# EAGLE design tof (EAGLE 6.5.0)
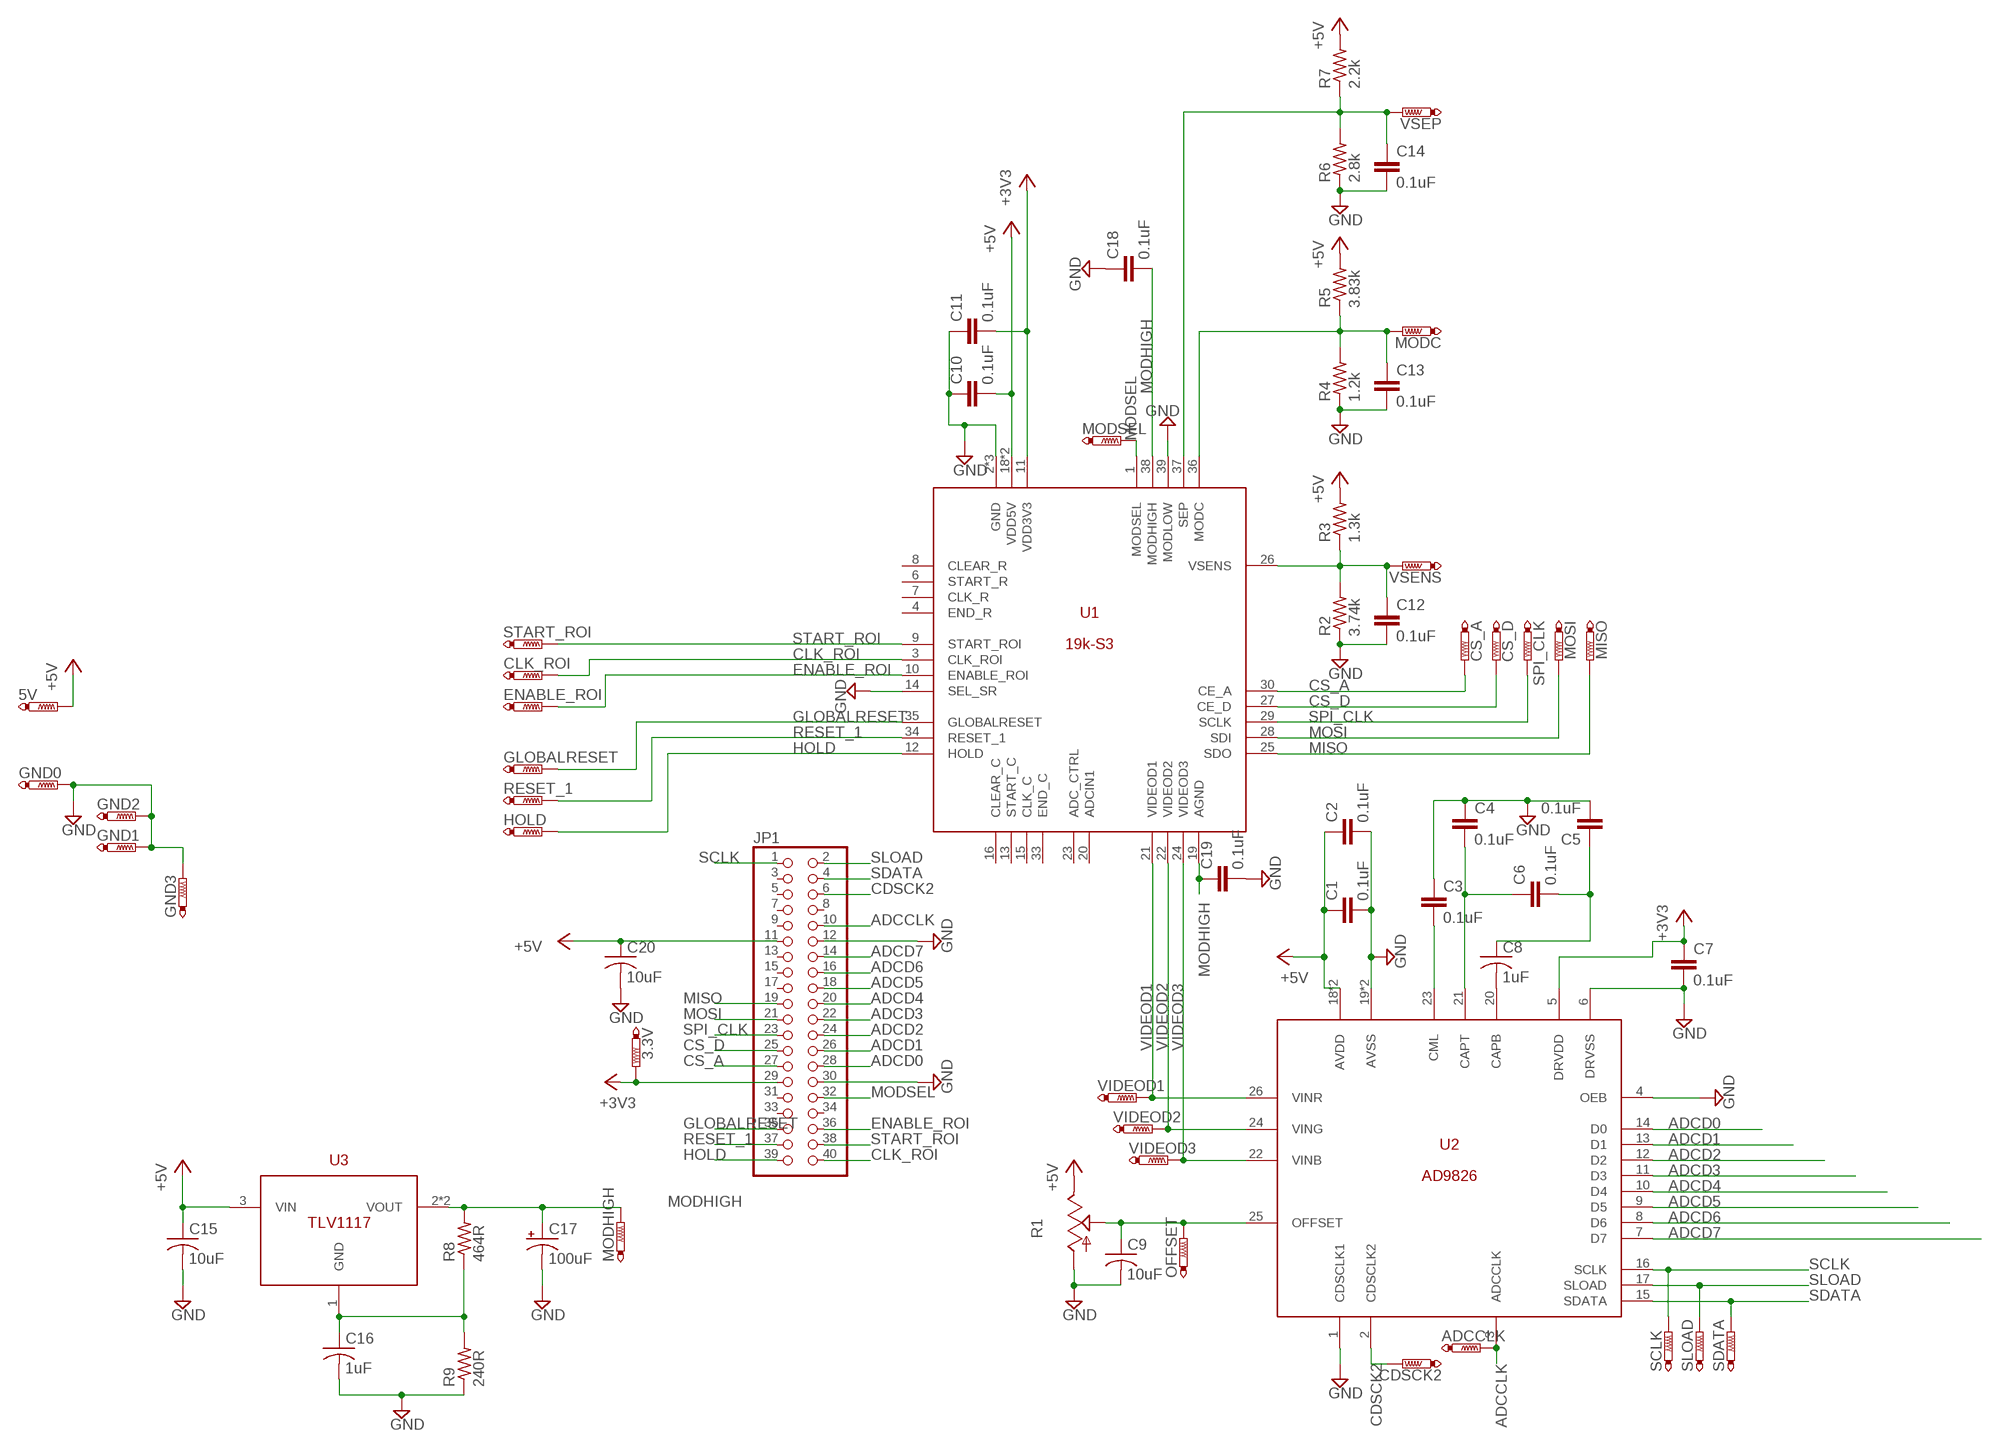
[diagram p0: schematic, sheet 1]

## Parts
3.3V  PTR1PAD1-13  [P1-13]
5V  PTR1PAD1-13  [P1-13]
ADCCLK  PTR1PAD1-13  [P1-13]
C1  0.1uF  C-EUC0805  [C0805]
C2  0.1uF  C-EUC0805  [C0805]
C3  0.1uF  C-EUC0805  [C0805]
C4  0.1uF  C-EUC0805  [C0805]
C5  0.1uF  C-EUC0805  [C0805]
C6  0.1uF  C-EUC0805  [C0805]
C7  0.1uF  C-EUC0805  [C0805]
C8  1uF  C-USC0805  [C0805]
C9  10uF  C-USC0805  [C0805]
C10  0.1uF  C-EUC0805  [C0805]
C11  0.1uF  C-EUC0805  [C0805]
C12  0.1uF  C-EUC0805  [C0805]
C13  0.1uF  C-EUC0805  [C0805]
C14  0.1uF  C-EUC0805  [C0805]
C15  10uF  C-USC0805  [C0805]
C16  1uF  C-USC0805  [C0805]
C17  100uF  CPOL-USF  [PANASONIC_F]
C18  0.1uF  C-EUC0805  [C0805]
C19  0.1uF  C-EUC0805  [C0805]
C20  10uF  C-USC0805  [C0805]
CDSCK2  PTR1PAD1-13  [P1-13]
CLK_ROI  PTR1PAD1-13  [P1-13]
CS_A  PTR1PAD1-13  [P1-13]
CS_D  PTR1PAD1-13  [P1-13]
ENABLE_ROI  PTR1PAD1-13  [P1-13]
GLOBALRESET  PTR1PAD1-13  [P1-13]
GND0  PTR1PAD1-13  [P1-13]
GND1  PTR1PAD1-13  [P1-13]
GND2  PTR1PAD1-13  [P1-13]
GND3  PTR1PAD1-13  [P1-13]
HOLD  PTR1PAD1-13  [P1-13]
JP1  PINHD-2X20  [SMD-40]
MISO  PTR1PAD1-13  [P1-13]
MODC  PTR1PAD1-13  [P1-13]
MODHIGH  PTR1PAD1-13  [P1-13]
MODSEL  PTR1PAD1-13  [P1-13]
MOSI  PTR1PAD1-13  [P1-13]
OFFSET  PTR1PAD1-13  [P1-13]
R1  TRIM_US-S63P  [S63P]
R2  3.74k  R-US_R0805  [R0805]
R3  1.3k  R-US_R0805  [R0805]
R4  1.2k  R-US_R0805  [R0805]
R5  3.83k  R-US_R0805  [R0805]
R6  2.8k  R-US_R0805  [R0805]
R7  2.2k  R-US_R0805  [R0805]
R8  464R  R-US_R0805  [R0805]
R9  240R  R-US_R0805  [R0805]
RESET_1  PTR1PAD1-13  [P1-13]
SCLK  PTR1PAD1-13  [P1-13]
SDATA  PTR1PAD1-13  [P1-13]
SLOAD  PTR1PAD1-13  [P1-13]
SPI_CLK  PTR1PAD1-13  [P1-13]
START_ROI  PTR1PAD1-13  [P1-13]
U1  19K-S3  [TLCC40]
U2  AD9826  [SSOP28]
U3  TLV1117  [SOT223]
VIDEOD1  PTR1PAD1-13  [P1-13]
VIDEOD2  PTR1PAD1-13  [P1-13]
VIDEOD3  PTR1PAD1-13  [P1-13]
VSENS  PTR1PAD1-13  [P1-13]
VSEP  PTR1PAD1-13  [P1-13]

## Nets
+3V3: 3.3V.TP C7.1 C11.2 JP1.29 U1.11(VDD3V3) U2.5(DRVDD)
+5V: 5V.TP C1.1 C2.1 C10.2 C15.1 C20.1 JP1.11 R1.E R3.2 R5.2 R7.2 U1.18(VDD5V) U1.40(VDD5V) U2.18(AVDD) U2.28(AVDD) U3.3(VIN)
ADCCLK: ADCCLK.TP JP1.10 U2.3(ADCCLK)
ADCD0: JP1.28 U2.14(D0)
ADCD1: JP1.26 U2.13(D1)
ADCD2: JP1.24 U2.12(D2)
ADCD3: JP1.22 U2.11(D3)
ADCD4: JP1.20 U2.10(D4)
ADCD5: JP1.18 U2.9(D5)
ADCD6: JP1.16 U2.8(D6)
ADCD7: JP1.14 U2.7(D7)
CAPT: C4.2 C6.1 U2.21(CAPT)
CDSCK2: CDSCK2.TP JP1.6 U2.2(CDSCLK2)
CLK_ROI: CLK_ROI.TP JP1.40 U1.3(CLK_ROI)
CML: C3.2 U2.23(CML)
CS_A: CS_A.TP JP1.27 U1.30(CE_A)
CS_D: CS_D.TP JP1.25 U1.27(CE_D)
ENABLE_ROI: ENABLE_ROI.TP JP1.36 U1.10(ENABLE_ROI)
GLOBALRESET: GLOBALRESET.TP JP1.35 U1.35(GLOBALRESET)
GND: C1.2 C2.2 C3.1 C4.1 C5.2 C7.2 C9.2 C10.1 C11.1 C12.2 C13.2 C14.2 C15.2 C16.2 C17.- C18.1 C19.2 C20.2 GND0.TP GND1.TP GND2.TP GND3.TP JP1.12 JP1.30 R1.A R2.1 R4.1 R6.1 R9.1 U1.2(GND) U1.5(GND) U1.14(SEL_SR) U1.39(MODLOW) U1.PAD(GND) U2.1(CDSCLK1) U2.4(OEB) U2.6(DRVSS) U2.19(AVSS) U2.27(AVSS)
HOLD: HOLD.TP JP1.39 U1.12(HOLD)
MISO: JP1.19 MISO.TP U1.25(SDO)
MODHIGH: C17.+ C18.2 C19.1 MODHIGH.TP R8.2 U1.19(AGND) U1.38(MODHIGH) U3.2(VOUT) U3.4(VOUT)
MODSEL: JP1.32 MODSEL.TP U1.1(MODSEL)
MOSI: JP1.21 MOSI.TP U1.28(SDI)
N$2: C9.1 OFFSET.TP R1.S U2.25(OFFSET)
N$3: C8.2 U2.20(CAPB)
N$4: C5.1 C6.2 C8.1
N$6: C16.1 R8.1 R9.2 U3.1(GND)
N$15: C12.1 R2.2 R3.1 U1.26(VSENS) VSENS.TP
N$17: C13.1 MODC.TP R4.2 R5.1 U1.36(MODC)
N$20: C14.1 R6.2 R7.1 U1.37(SEP) VSEP.TP
RESET_1: JP1.37 RESET_1.TP U1.34(RESET_1)
SCLK: JP1.1 SCLK.TP U2.16(SCLK)
SDATA: JP1.4 SDATA.TP U2.15(SDATA)
SLOAD: JP1.2 SLOAD.TP U2.17(SLOAD)
SPI_CLK: JP1.23 SPI_CLK.TP U1.29(SCLK)
START_ROI: JP1.38 START_ROI.TP U1.9(START_ROI)
VIDEOD1: U1.21(VIDEOD1) U2.26(VINR) VIDEOD1.TP
VIDEOD2: U1.22(VIDEOD2) U2.24(VING) VIDEOD2.TP
VIDEOD3: U1.24(VIDEOD3) U2.22(VINB) VIDEOD3.TP
Unconnected: JP1.3 JP1.5 JP1.7 JP1.8 JP1.9 JP1.13 JP1.15 JP1.17 JP1.31 JP1.33 JP1.34 U1.4(END_R) U1.6(START_R) U1.7(CLK_R) U1.8(CLEAR_R) U1.13(START_C) U1.15(CLK_C) U1.16(CLEAR_C) U1.20(ADCIN1) U1.23(ADC_CTRL) U1.33(END_C)

## Library data of the parts
3.3V 5V ADCCLK CDSCK2 CLK_ROI CS_A CS_D ENABLE_ROI GLOBALRESET GND0 GND1-GND3 HOLD MISO MODC MODHIGH MODSEL MOSI OFFSET RESET_1 SCLK SDATA SLOAD SPI_CLK START_ROI VIDEOD1-VIDEOD3 VSENS VSEP = testpad:PTR1: TEST PIN
C1-C7 C10-C14 C18 C19 = rcl:C-EU: CAPACITOR, European symbol
C8 C9 C15 C16 C20 = rcl:C-US: CAPACITOR, American symbol
C17 = rcl:CPOL-US: POLARIZED CAPACITOR, American symbol
JP1 = tof_v3:PINHD-2X20: PIN HEADER
R1 = pot:TRIM_US-: POTENTIOMETER
R2-R9 = rcl:R-US_: RESISTOR, American symbol
U1 = tof_v3:19K-S3
U2 = tof_v3:AD9826: 16-bit RGB ADC
U3 = tof_v3:TLV1117: Adjustable Voltage Regulator

## Board
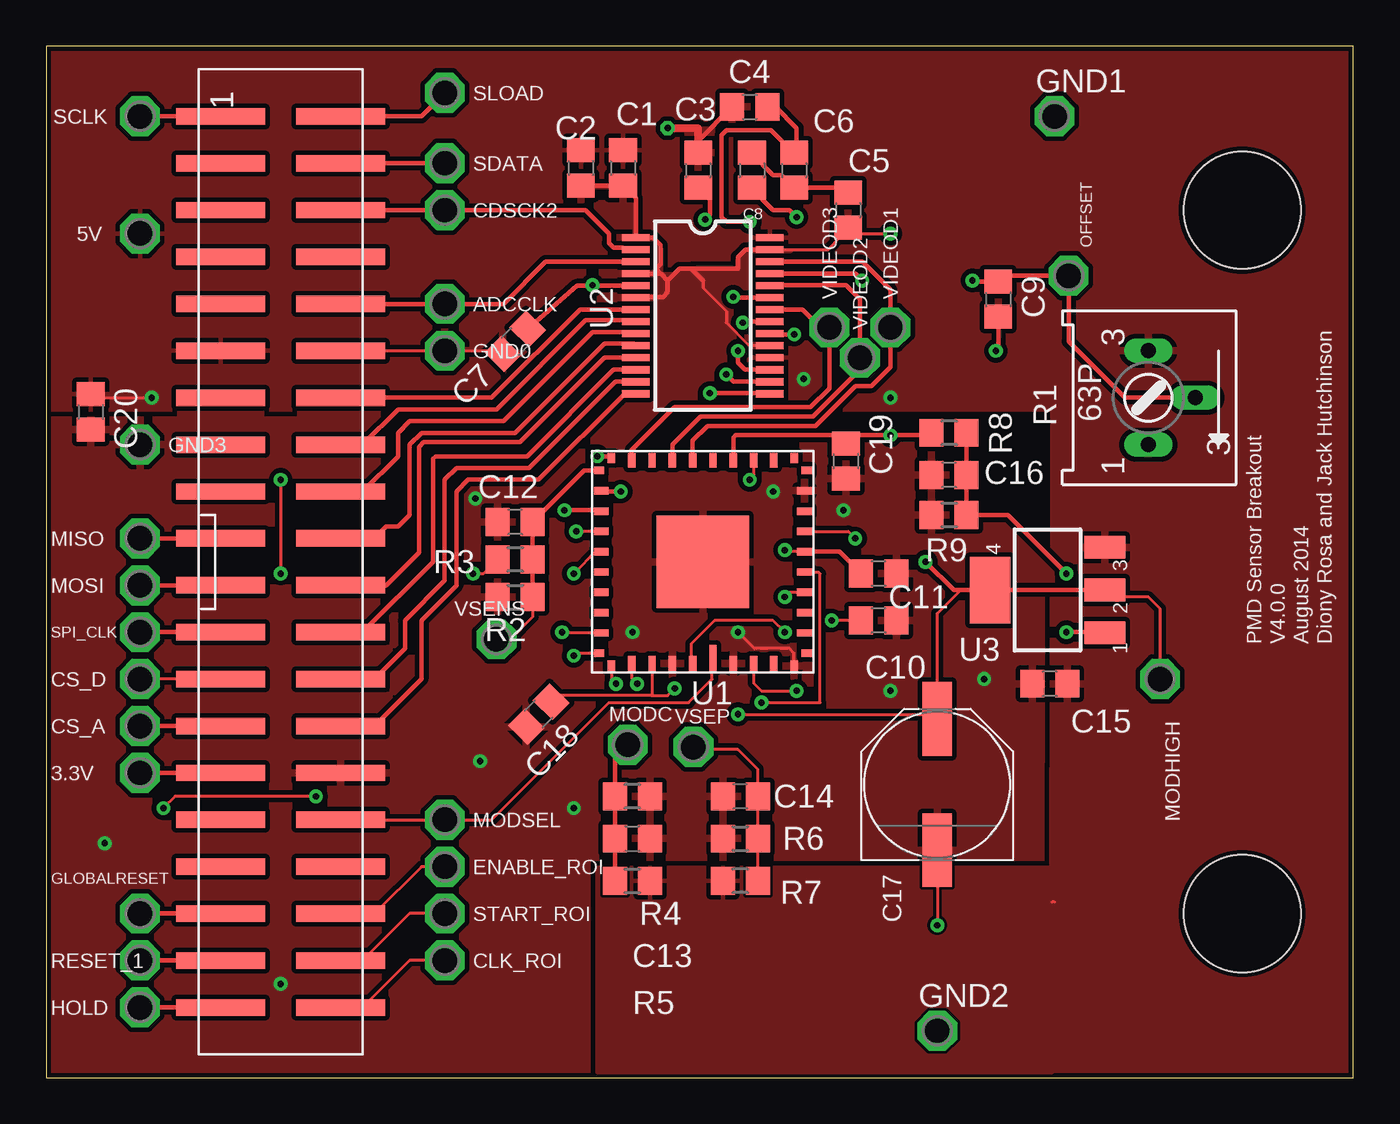
[diagram p1: board, top side]
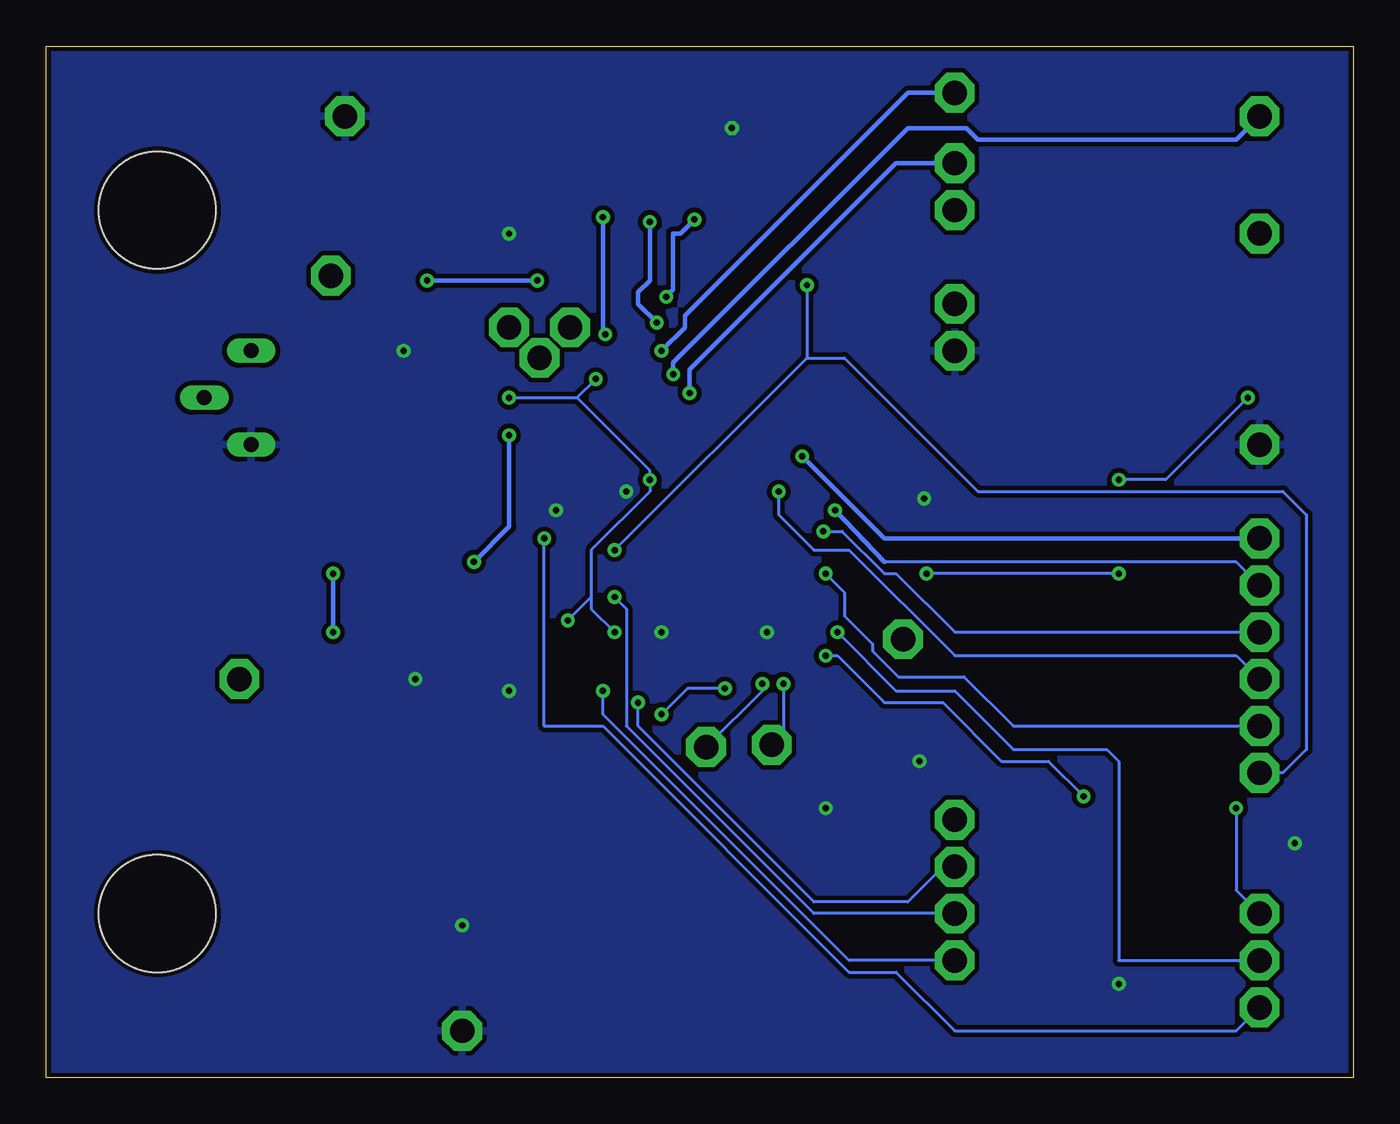
[diagram p2: board, bottom side, seen from below]

Size 70.79 x 55.87 mm. Coordinates in mm from the lower left corner, seen from the top.
Outline: 0,0 70.79,0 70.79,55.87 0,55.87 0,0
Copper layers (1*16): Top 0.035mm / dielectric 1.5mm / Bottom 0.035mm
Design rules "default *": minimum track width 6mil, minimum drill 10mil, track to track 6mil, track to pad 6mil, pad to pad 6mil, via to via 6mil, smd to smd 6mil, copper to edge 6mil, drill to drill 6mil, minimum pad ring 10mil, minimum via ring 8mil, stop-mask expansion 4mil, vias tented up to drill 0mil, thermal gap 10mil
Holes 6.35 mm at 64.77,46.99 64.77,8.89

### Footprints (pad centres in the part's own frame; a part is rotated, then mirrored left to right if it is on the bottom)
P1-13 = drill 1.321 pad 2.159 octagon: TP 0,0
C0805 = smd 1.3 x 1.5: 1 -0.95,0; 2 0.95,0
PANASONIC_F = smd 4 x 1.6: + 3.55,0; - -3.55,0
SMD-40 = smd 0.889 x 4.801: 1 -24.13,-3.251; 2 -24.13,3.251; 3 -21.59,-3.251; 4 -21.59,3.251; 5 -19.05,-3.251; 6 -19.05,3.251; 7 -16.51,-3.251; 8 -16.51,3.251; 9 -13.97,-3.251; 10 -13.97,3.251; 11 -11.43,-3.251; 12 -11.43,3.251; 13 -8.89,-3.251; 14 -8.89,3.251; 15 -6.35,-3.251; 16 -6.35,3.251; 17 -3.81,-3.251; 18 -3.81,3.251; 19 -1.27,-3.251; 20 -1.27,3.251; 21 1.27,-3.251; 22 1.27,3.251; 23 3.81,-3.251; 24 3.81,3.251; 25 6.35,-3.251; 26 6.35,3.251; 27 8.89,-3.251; 28 8.89,3.251; 29 11.43,-3.251; 30 11.43,3.251; 31 13.97,-3.251; 32 13.97,3.251; 33 16.51,-3.251; 34 16.51,3.251; 35 19.05,-3.251; 36 19.05,3.251; 37 21.59,-3.251; 38 21.59,3.251; 39 24.13,-3.251; 40 24.13,3.251
S63P = drill 0.813 long: A 2.54,0; E -2.54,0; S 0,2.54
R0805 = smd 1.3 x 1.5: 1 -0.95,0; 2 0.95,0
TLCC40 = smd 0.4 x 1.4: 1 -0.55,5.2 | smd 0.4 x 0.8: 2 -1.65,5.5; 3 -2.75,5.5; 4 -3.85,5.5; 17 -3.85,-5.5; 18 -2.75,-5.5; 19 -1.65,-5.5; 20 -0.55,-5.5; 21 0.55,-5.5; 22 1.65,-5.5; 23 2.75,-5.5; 24 3.85,-5.5; 37 3.85,5.5; 38 2.75,5.5; 39 1.65,5.5; 40 0.55,5.5 | smd 0.4 x 0.55: 5 -4.95,5.625; 16 -4.95,-5.625; 25 4.95,-5.625; 36 4.95,5.625 | smd 0.55 x 0.4: 6 -5.625,4.95; 15 -5.625,-4.95; 26 5.625,-4.95; 35 5.625,4.95 | smd 0.8 x 0.4: 7 -5.5,3.85; 8 -5.5,2.75; 9 -5.5,1.65; 10 -5.5,0.55; 11 -5.5,-0.55; 12 -5.5,-1.65; 13 -5.5,-2.75; 14 -5.5,-3.85; 27 5.5,-3.85; 28 5.5,-2.75; 29 5.5,-1.65; 30 5.5,-0.55; 31 5.5,0.55; 32 5.5,1.65; 33 5.5,2.75; 34 5.5,3.85 | smd 5 x 5: PAD 0,0
SSOP28 = smd 0.4 x 1.5: 1 -4.225,-3.625; 2 -3.575,-3.625; 3 -2.925,-3.625; 4 -2.275,-3.625; 5 -1.625,-3.625; 6 -0.975,-3.625; 7 -0.325,-3.625; 8 0.325,-3.625; 9 0.975,-3.625; 10 1.625,-3.625; 11 2.275,-3.625; 12 2.925,-3.625; 13 3.575,-3.625; 14 4.225,-3.625; 15 4.225,3.625; 16 3.575,3.625; 17 2.925,3.625; 18 2.275,3.625; 19 1.625,3.625; 20 0.975,3.625; 21 0.325,3.625; 22 -0.325,3.625; 23 -0.975,3.625; 24 -1.625,3.625; 25 -2.275,3.625; 26 -2.925,3.625; 27 -3.575,3.625; 28 -4.225,3.625
SOT223 = smd 1.219 x 2.235: 1 -2.311,-3.099; 2 0,-3.099; 3 2.311,-3.099 | smd 3.6 x 2.2: 4 0,3.099

### Placement (x,y rotation side)
3.3V  5.08,16.51 0 top
5V  5.08,45.72 0 top
ADCCLK  21.59,41.91 0 top
C1  31.24,49.28 270 top
C2  28.96,49.28 270 top
C3  35.31,49.15 270 top
C4  38.1,52.58 0 top
C5  43.43,46.99 270 top
C6  40.51,49.15 270 top
C7  25.4,39.88 225 top
C8  38.23,49.15 270 top
C9  51.56,42.16 270 top
C10  45.09,24.77 180 top
C11  45.09,27.3 180 top
C12  25.4,30.1 180 top
C13  31.75,12.95 0 top
C14  37.59,15.24 180 top
C15  54.36,21.34 180 top
C16  48.9,32.64 180 top
C17  48.26,15.88 90 top
C18  26.67,19.68 45 top
C19  43.31,33.4 270 top
C20  2.41,36.07 270 top
CDSCK2  21.59,46.99 0 top
CLK_ROI  21.59,6.35 0 top
CS_A  5.08,19.05 0 top
CS_D  5.08,21.59 0 top
ENABLE_ROI  21.59,11.43 0 top
GLOBALRESET  5.08,8.89 0 top
GND0  21.59,39.37 0 top
GND1  54.61,52.07 0 top
GND2  48.26,2.54 0 top
GND3  5.08,34.29 0 top
HOLD  5.08,3.81 0 top
JP1  12.7,27.94 270 top
MISO  5.08,29.21 0 top
MODC  31.5,18.03 0 top
MODHIGH  60.33,21.59 90 top
MODSEL  21.59,13.97 0 top
MOSI  5.08,26.67 0 top
OFFSET  55.37,43.43 90 top
R1  59.69,36.83 270 top
R2  25.4,26.04 0 top
R3  25.4,28.07 180 top
R4  31.75,15.24 180 top
R5  31.75,10.67 0 top
R6  37.59,12.95 0 top
R7  37.59,10.67 180 top
R8  48.9,34.92 180 top
R9  48.9,30.48 0 top
RESET_1  5.08,6.35 0 top
SCLK  5.08,52.07 0 top
SDATA  21.59,49.53 0 top
SLOAD  21.59,53.34 0 top
SPI_CLK  5.08,24.13 0 top
START_ROI  21.59,8.89 0 top
U1  35.56,27.94 180 top
U2  35.56,41.27 270 top
U3  54.23,26.42 90 top
VIDEOD1  45.72,40.64 90 top
VIDEOD2  44.07,38.99 90 top
VIDEOD3  42.42,40.64 90 top
VSENS  24.38,23.75 0 top
VSEP  35.05,17.91 0 top

### Tracks (layer width: path | path; a pad name or v marks a point on that pad's centre or on a via)
+3V3  (via drill 0.34)
  Top 0.152: 28.74,42.9 29.57,42.9 v29.59,42.93 | U1.11 40.09,28.49 v40.01,28.57
  Top 0.254: U2.5 28.74,42.9 C7.1 | U1.11 42.95,28.49 C11.2 | 3.3V.TP JP1.29
  Bottom 0.152: v29.59,42.93 29.59,38.99 | 29.59,38.99 v40.01,28.57 | 29.59,38.99 27.56,38.99 20.32,31.75 3.81,31.75 2.54,30.48 2.54,17.78 3.81,16.51 3.3V.TP
+5V  (via drill 0.34)
  Top 0.152: U1.18 38.31,32.59 v38.1,32.38 | C10.2 v42.55,24.77 | v40.01,24.13 39.37,24.77 36.2,24.77 34.92,23.5 34.92,22.52 U1.40 | v12.7,32.38 v12.7,27.3 | v5.71,36.83 2.54,36.83 C20.1 | v23.11,27.3 23.69,27.3 R3.2 | 54.61,9.53 54.48,9.53
  Bottom 0.152: v45.72,36.83 42.04,36.83 | 42.04,36.83 v41.02,37.85 | 42.04,36.83 38.1,32.89 v38.1,32.38 38.1,31.75 41.27,28.57 41.27,26.04 | 41.27,26.04 v42.55,24.77 | 41.27,26.04 41.27,25.4 v40.01,24.13 | v12.7,27.3 v23.11,27.3 | v12.7,32.38 10.16,32.38 v5.71,36.83
  pour Top (isolate 0.254): 0.13,55.88 70.74,55.88 70.74,36.2 0.13,36.2
  pour Top (isolate 0.254): 70.48,44.45 54.61,44.45 54.48,0.25 70.36,0.25
  pour Top (isolate 0.254): 0.25,44.32 0.25,39.24 12.7,39.37 12.7,44.45
  pour Top: 54.48,0.25 29.84,0.25 29.84,11.43 54.48,11.43
ADCCLK
  Top 0.254: JP1.10 ADCCLK.TP 24.77,41.91 27.05,44.2 U2.3
ADCD0
  Top 0.254: U2.14 31.34,37.05 26.67,32.38 22.86,32.38 22.23,31.75 22.23,26.67 20.32,24.77 20.32,21.59 17.78,19.05 JP1.28
ADCD1
  Top 0.254: U2.13 30.84,37.7 26.16,33.02 22.23,33.02 21.59,32.38 21.59,26.92 19.43,24.77 19.43,23.24 17.78,21.59 JP1.26
ADCD2
  Top 0.254: U2.12 30.73,38.35 26.04,33.66 21.08,33.66 20.95,33.53 20.95,27.94 17.14,24.13 JP1.24
ADCD3
  Top 0.254: U2.11 30.24,39 25.65,34.42 20.45,34.42 20.19,34.16 20.19,28.45 18.41,26.67 JP1.22
ADCD4
  Top 0.254: JP1.20 17.78,29.21 18.41,29.84 19.05,29.84 19.68,30.48 19.68,34.29 20.32,34.92 25.4,34.92 30.23,39.75 31.83,39.75 U2.10
ADCD5
  Top 0.254: JP1.18 17.14,31.75 19.05,33.66 19.05,34.92 19.68,35.56 24.77,35.56 29.59,40.39 31.85,40.39 U2.9
ADCD6
  Top 0.254: JP1.16 17.14,34.29 19.05,36.2 24.38,36.2 29.21,41.02 31.86,41.02 U2.8
ADCD7
  Top 0.152: JP1.14 16.51,36.83
  Top 0.254: U2.7 28.9,41.6 24.13,36.83 16.51,36.83
CAPT  (via drill 0.34)
  Top 0.254: C4.2 39.5,52.58 40.64,51.44 40.64,50.23 C6.1 40.45,50.1 39.24,51.31 36.83,51.31 36.58,51.05 36.58,46.61 36.83,46.35 v38.1,46.35 | U2.21 37.77,40.95 v37.72,40.89
  Bottom 0.254: v38.1,46.35 38.1,43.18 38.73,42.55 38.73,41.91 v37.72,40.89
CDSCK2
  Top 0.254: JP1.6 CDSCK2.TP 29.21,46.99 30.48,45.72 30.48,45.21 30.73,44.96 31.24,44.96 31.35,44.85 U2.2
CLK_ROI  (via drill 0.34)
  Top 0.152: U1.3 38.31,21.38 38.73,20.95 v40.64,20.95 | CLK_ROI.TP 19.68,6.35 17.14,3.81 JP1.40
  Bottom 0.152: v40.64,20.95 40.64,19.68 27.3,6.35 CLK_ROI.TP
CML  (via drill 0.34)
  Top 0.254: U2.23 37.25,42.25 v37.21,42.29 | C3.2 35.94,47.56 35.94,46.74 v35.69,46.48
  Bottom 0.254: v37.21,42.29 36.83,42.67 36.83,45.72 36.45,45.72 v35.69,46.48
CS_A  (via drill 0.34)
  Top 0.152: U1.30 29.76,28.49 v28.57,27.3
  Top 0.254: CS_A.TP JP1.27
  Bottom 0.152: v28.57,27.3 27.56,26.29 27.56,25.02 26.04,23.5 26.04,23.11 24.64,21.72 21.08,21.72 18.41,19.05 CS_A.TP
CS_D  (via drill 0.34)
  Top 0.152: JP1.25 CS_D.TP
  Top 0.254: U1.27 29.84,31.75 v31.11,31.75
  Bottom 0.152: v31.11,31.75 31.11,30.48 29.21,28.57 27.3,28.57 21.59,22.86 6.35,22.86 CS_D.TP
ENABLE_ROI  (via drill 0.34)
  Top 0.152: ENABLE_ROI.TP 20.32,11.43 17.78,8.89 JP1.36 | v38.73,20.32 41.91,20.32 41.91,27.3 41.83,27.39 U1.10
  Bottom 0.152: v38.73,20.32 38.73,19.05 29.21,9.53 24.13,9.53 22.23,11.43 ENABLE_ROI.TP
GLOBALRESET  (via drill 0.34)
  Top 0.152: U1.35 28.7,22.99 v28.57,22.86 | v14.61,15.24 6.99,15.24 v6.35,14.61
  Top 0.254: GLOBALRESET.TP JP1.35
  Bottom 0.152: v28.57,22.86 27.94,22.86 25.4,20.32 22.23,20.32 19.05,17.14 16.51,17.14 v14.61,15.24 | v6.35,14.61 6.35,10.16 GLOBALRESET.TP
GND  (via drill 0.34)
  Top 0.152: C17.- v48.26,8.26 | U1.5 40.51,22.99 40.26,23.24 38.35,23.24 v37.47,24.13 | U2.19 38.07,39.65 36.83,40.89 36.83,41.53 35.56,42.8 35.56,43.18 | U2.27 42.37,44.85 C5.2 43.75,45.72 v45.72,45.72 | JP1.12 GND0.TP 24.56,39.37 C7.2
  Top 0.254: C2.2 C1.2 31.93,47.63 U2.1 32.86,45.5 33.27,45.09 33.27,44.07 33.02,43.81 33.27,43.56 U2.4 33.28,43.55 33.66,43.18 | 33.66,43.18 33.66,42.55 33.4,42.29 31.98,42.29 U2.6 | U2.27 37.87,44.85 37.47,44.45 37.47,43.81 34.92,43.81 | 33.66,43.18 34.29,43.81 34.92,43.81 | 34.92,43.81 35.56,43.18 | C9.2 51.56,39.5 v51.44,39.37 | C3.1 35.31,50.73 C4.1
  Top 0.406: v33.66,51.44 35.31,51.44 35.31,50.73
  other vias: 31.75,24.13 39.37,31.75 43.18,30.73 23.5,17.14 28.57,14.61 45.72,20.95 50.8,21.59 3.17,12.7 12.7,5.08 23.24,31.37
  pour Bottom (isolate 0.254): 0,55.88 71.12,55.88 71.12,0 0,0
  pour Top (isolate 0.254, rank 2): 0,55.88 70.48,55.88 70.48,0 0,0
HOLD  (via drill 0.34)
  Top 0.152: U1.12 43.44,29.59 v43.81,29.21
  Top 0.254: HOLD.TP JP1.39
  Bottom 0.152: v43.81,29.21 43.81,19.05 40.64,19.05 27.3,5.71 24.77,5.71 21.59,2.54 6.35,2.54 HOLD.TP
MISO  (via drill 0.34)
  Top 0.254: v29.84,33.66 30.48,33.66 U1.25 | MISO.TP JP1.19
  Bottom 0.254: MISO.TP 25.4,29.21 v29.84,33.66
MODHIGH  (via drill 0.34)
  Top 0.152: U1.38 32.81,20.75 32.77,20.7 | 32.77,20.7 27.69,20.7 C18.2 | MODHIGH.TP 60.33,25.4 59.69,26.04 57.71,26.04 U3.2 | C17.+ 48.26,19.68 | 48.26,19.68 48.26,25.15 49.53,26.42 | 32.77,20.7 33.66,20.7 v34.04,21.08 | v37.47,19.68 48.26,19.68
  Top 0.254: U1.19 37.21,34.67 37.34,34.8 43.31,34.8 | 43.31,34.8 C19.1 | 43.31,34.8 v45.72,34.8 47.82,34.8 R8.2 | U3.2 U3.4 49.53,26.42 49.15,26.42 v47.62,27.94
  Bottom 0.152: v34.04,21.08 36.07,21.08 v37.47,19.68
  Bottom 0.254: v47.62,27.94 45.72,29.84 v45.72,34.8
MODSEL
  Top 0.152: JP1.32 MODSEL.TP 24.13,13.97 30.48,20.32 34.8,20.32 36.07,21.59 36.07,22.7 U1.1
MOSI  (via drill 0.34)
  Top 0.254: MOSI.TP JP1.21 | v28.07,30.73 30.02,30.73 U1.28
  Bottom 0.152: MOSI.TP 6.35,27.94 25.4,27.94
  Bottom 0.254: 25.4,27.94 v28.07,30.73
N$2  (via drill 0.34)
  Top 0.254: v50.16,43.18 50.23,43.11 C9.1 51.88,43.43 OFFSET.TP 55.37,39.88 58.42,36.83 R1.S | U2.25 43.83,43.55 v44.2,43.18
  Bottom 0.254: v50.16,43.18 v44.2,43.18
N$3  (via drill 0.34)
  Top 0.254: C8.2 38.16,48.2 | 38.16,48.2 38.1,48.26 | 38.16,48.2 39.37,46.99 40.26,46.99 v40.64,46.61 | v40.51,40.26 39.23,40.26 U2.20
  Bottom 0.254: v40.64,46.61 40.64,40.39 v40.51,40.26
N$4
  Top 0.254: C8.1 38.23,50.04 39.37,48.9 39.82,48.9 C6.2 43.18,48.2 C5.1
N$6  (via drill 0.34)
  Top 0.254: R8.1 C16.1 R9.2 52.07,30.48 v55.24,27.3 | v55.24,24.13 57.3,24.13 U3.1
  Bottom 0.254: v55.24,27.3 v55.24,24.13
N$15
  Top 0.152: R2.2 26.35,24.96 25.14,23.75 VSENS.TP
  Top 0.254: R2.2 R3.1 C12.1 29.14,32.89 U1.26
N$17  (via drill 0.34)
  Top 0.152: U1.36 30.61,21.59 v30.86,21.34
  Top 0.254: MODC.TP 30.8,17.34 R4.2 R5.1 C13.1
  Bottom 0.152: v30.86,21.34 30.86,18.67 MODC.TP
N$20  (via drill 0.34)
  Top 0.152: R7.1 R6.2 C14.1 38.54,16.7 37.47,17.78 35.18,17.78 VSEP.TP | U1.37 31.71,21.63 v32,21.34
  Bottom 0.152: v32,21.34 32,20.95 VSEP.TP
RESET_1  (via drill 0.34)
  Top 0.152: U1.34 27.98,24.09 v27.94,24.13
  Top 0.254: RESET_1.TP JP1.37
  Bottom 0.152: v27.94,24.13 24.77,20.95 21.59,20.95 18.41,17.78 13.34,17.78 12.7,17.14 12.7,6.35 RESET_1.TP
SCLK  (via drill 0.34)
  Top 0.254: JP1.1 SCLK.TP | U2.16 37.23,37.7 v36.83,38.1
  Bottom 0.254: SCLK.TP 6.35,50.8 20.32,50.8 20.95,51.44 24.13,51.44 36.83,38.73 v36.83,38.1
SDATA  (via drill 0.34)
  Top 0.254: JP1.4 SDATA.TP | v35.94,37.08 39.15,37.08 U2.15
  Bottom 0.254: v35.94,37.08 35.94,38.35 24.77,49.53 SDATA.TP
SLOAD  (via drill 0.34)
  Top 0.254: JP1.2 20.32,52.07 SLOAD.TP | U2.17 37.85,38.35 37.47,38.73 v37.47,39.37
  Bottom 0.254: SLOAD.TP 24.13,53.34 36.2,41.27 36.2,40.64 v37.47,39.37
SPI_CLK  (via drill 0.34)
  Top 0.152: U1.29 v28.7,29.59
  Top 0.254: SPI_CLK.TP JP1.23
  Bottom 0.152: v28.7,29.59 27.69,29.59 25.4,27.3 24.77,27.3 21.59,24.13 SPI_CLK.TP
START_ROI  (via drill 0.34)
  Top 0.152: U1.9 40.26,26.29 v40.01,26.04 | START_ROI.TP 19.68,8.89 17.14,6.35 JP1.38
  Bottom 0.152: v40.01,26.04 39.37,25.4 39.37,19.05 29.21,8.89 START_ROI.TP
VIDEOD1
  Top 0.254: U2.26 44.2,44.2 45.72,42.67 VIDEOD1.TP 45.72,38.48 44.7,37.47 43.81,37.47 41.66,35.31 35.81,35.31 35.01,34.5 U1.21
VIDEOD2
  Top 0.254: U1.22 33.91,34.29 35.43,35.81 41.53,35.81 43.81,38.1 43.81,38.73 VIDEOD2.TP 44.07,42.16 43.31,42.93 39.21,42.93 U2.24
VIDEOD3
  Top 0.254: U1.24 31.71,34 34.04,36.32 41.4,36.32 42.42,37.34 VIDEOD3.TP 41.91,40.64 40.95,41.6 U2.22

### Text on the board
tNames: PMD Sensor Breakout | V4.0.0 | August 2014 | Diony Rosa and Jack Hutchinson